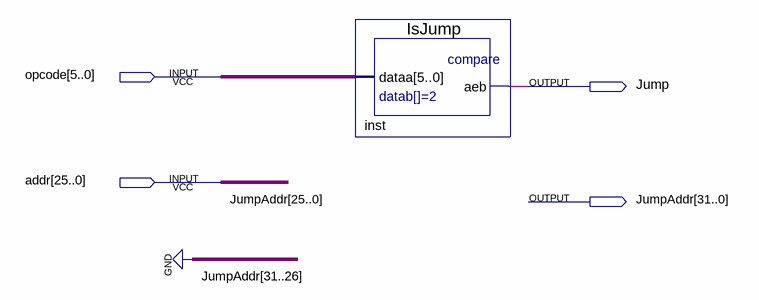
[diagram p0: schematic sheet]
// Quartus schematic JumpDetect.bdf as structural Verilog: 1 symbols, 4 pins
module JumpDetect (
  input  [5:0] opcode,
  input  [25:0] addr,
  output Jump,
  output [31:0] JumpAddr
);

  IsJump inst (.dataa(opcode), .aeb(Jump));

  assign JumpAddr = {{6{1'b0}}, addr};
endmodule
